# EAGLE design ethernet_dip_v1 (EAGLE 6.5.0)
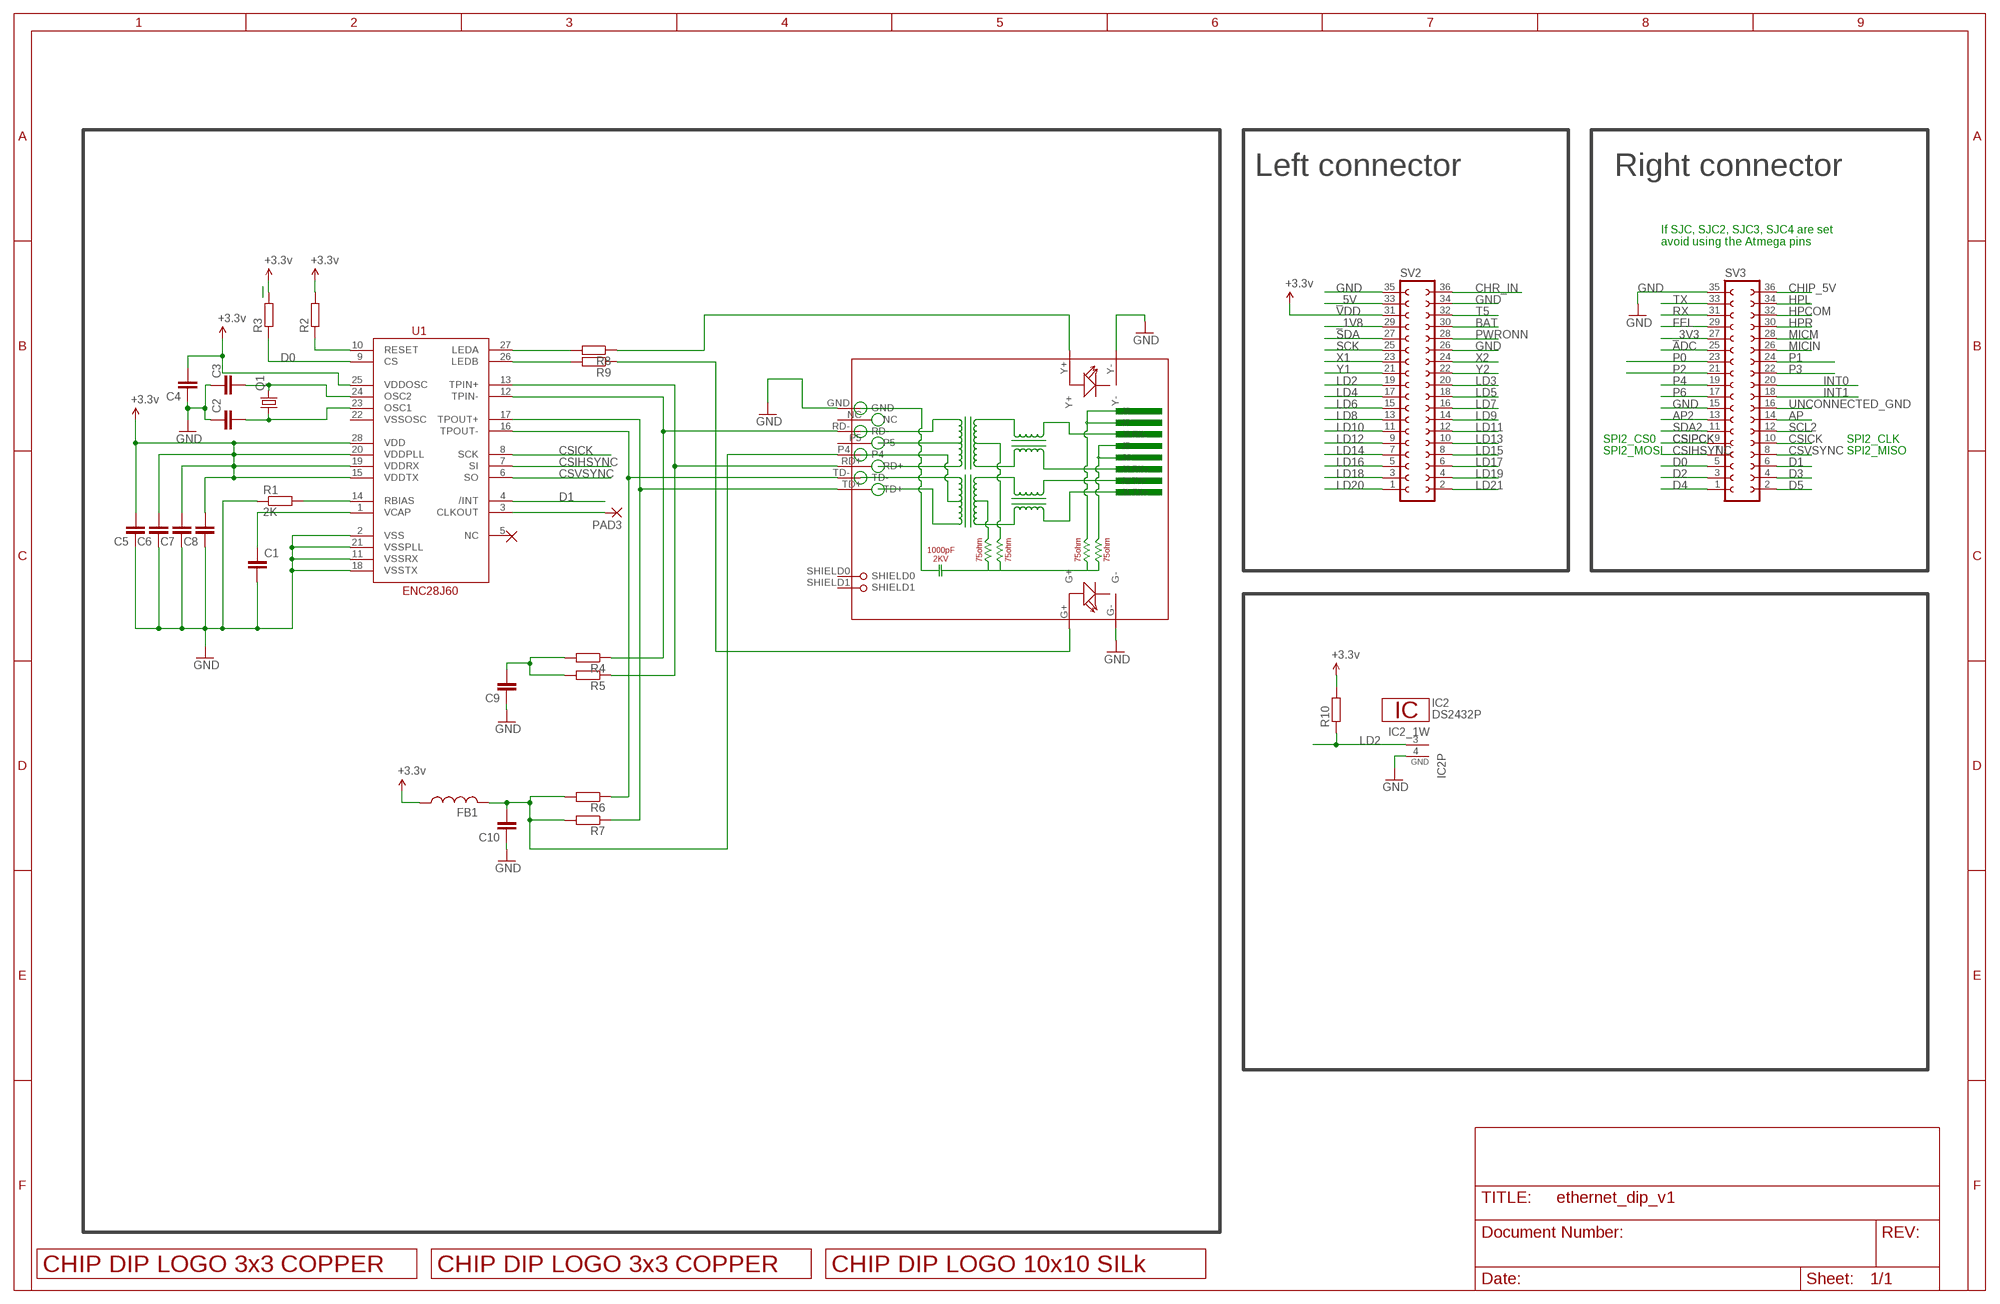
[diagram p0: schematic, sheet 1]

## Parts
C1  C-EUC0805  [C0805]
C2  C-EUC0805  [C0805]
C3  C-EUC0805  [C0805]
C4  C-EUC0805  [C0805]
C5  C-EUC0805  [C0805]
C6  C-EUC0805  [C0805]
C7  C-EUC0805  [C0805]
C8  C-EUC0805  [C0805]
C9  C-EUC0805  [C0805]
C10  C-EUC0805  [C0805]
FB1  FERRITE-BEADB  [0805]
IC2  DS2432P  [TSOC6]
PAD3  WIREPADSMD1,27-254  [SMD1,27-2,54]
Q1  CRYSTALSM49  [SM49]
R1  2K  R-EU_R0805  [R0805]
R2  R-EU_R0805  [R0805]
R3  R-EU_R0805  [R0805]
R4  R-EU_R0805  [R0805]
R5  R-EU_R0805  [R0805]
R6  R-EU_R0805  [R0805]
R7  R-EU_R0805  [R0805]
R8  R-EU_R0805  [R0805]
R9  R-EU_R0805  [R0805]
R10  R-EU_R0805  [R0805]
RJ1  HR911105A  [HR911105A]
SV2  FE18-2  [FE18-2]
SV3  FE18-2  [FE18-2]
U1  ENC28J60  [SSOP28DB]
U$2  LOGO_3X3_COPPER  [LOGO_3X3_COPPER]
U$4  LOGO_3X3_COPPER  [LOGO_3X3_COPPER]
U$5  LOGO_10X10_SILK  [LOGO_10X10_SILK]

## Nets
_1V8: SV2.29
_3V3: SV3.27
_5V: SV2.33
ADC: SV3.25
AP: SV3.14
AP2: SV3.13
BAT: SV2.30
CHIP_5V: SV3.36
CHR_IN: SV2.36
CSICK: SV3.10 U1.8(SCK)
CSIHSYNC: SV3.7 U1.7(SI)
CSIPCK: SV3.9
CSVSYNC: SV3.8 U1.6(SO)
CT: C10.2 FB1.2 R6.2 R7.2 RJ1.P4
D0: R3.1 SV3.5 U1.9(CS)
D1: SV3.6 U1.4(/INT)
D2: SV3.3
D3: SV3.4
D4: SV3.1
D5: SV3.2
FEL: SV3.29
GND: C1.2 C2.1 C3.1 C4.1 C5.1 C6.1 C7.1 C8.1 C9.1 C10.1 IC2.4(GND) R1.1 RJ1.G- RJ1.GND RJ1.Y- SV2.26 SV2.34 SV2.35 SV3.15 SV3.35 U1.2(VSS) U1.11(VSSRX) U1.18(VSSTX) U1.21(VSSPLL)
HPCOM: SV3.32
HPL: SV3.34
HPR: SV3.30
INT0: SV3.20
INT1: SV3.18
LD2: IC2.3(1W) R10.1 SV2.19
LD3: SV2.20
LD4: SV2.17
LD5: SV2.18
LD6: SV2.15
LD7: SV2.16
LD8: SV2.13
LD9: SV2.14
LD10: SV2.11
LD11: SV2.12
LD12: SV2.9
LD13: SV2.10
LD14: SV2.7
LD15: SV2.8
LD16: SV2.5
LD17: SV2.6
LD18: SV2.3
LD19: SV2.4
LD20: SV2.1
LD21: SV2.2
MICIN: SV3.26
MICM: SV3.28
N$1: C1.1 U1.1(VCAP)
N$2: R2.1 U1.10(RESET)
N$3: R1.2 U1.14(RBIAS)
N$6: C3.2 Q1.2 U1.24(OSC2)
N$7: C2.2 Q1.1 U1.23(OSC1)
N$10: R8.1 RJ1.Y+
N$11: R9.1 RJ1.G+
N$13: PAD3.1(P) U1.3(CLKOUT)
N$14: C9.2 R4.2 R5.2
N$15: R8.2 U1.27(LEDA)
N$16: R9.2 U1.26(LEDB)
P0: SV3.23
P1: SV3.24
P2: SV3.21
P3: SV3.22
P4: SV3.19
P6: SV3.17
PWRONN: SV2.28
RD+: R5.1 RJ1.RD+ U1.13(TPIN+)
RD-: R4.1 RJ1.RD- U1.12(TPIN-)
RX: SV3.31
SCK: SV2.25
SCL2: SV3.12
SDA: SV2.27
SDA2: SV3.11
T5: SV2.32
TD+: R7.1 RJ1.TD+ U1.17(TPOUT+)
TD-: R6.1 RJ1.TD- U1.16(TPOUT-)
TX: SV3.33
UNCONNECTED_GND: SV3.16
VDD: C4.2 C5.2 C6.2 C7.2 C8.2 FB1.1 R2.2 R3.2 R10.2 SV2.31 U1.15(VDDTX) U1.19(VDDRX) U1.20(VDDPLL) U1.25(VDDOSC) U1.28(VDD) ; supply symbol labelled +3.3v
X1: SV2.23
X2: SV2.24
Y1: SV2.21
Y2: SV2.22
Unconnected: RJ1.NC RJ1.P5 RJ1.SHIELD0 RJ1.SHIELD1 U1.5(NC) U1.22(VSSOSC)

## Notes on the sheet
- Left connector | Right connector
- If SJC, SJC2, SJC3, SJC4 are set 
  avoid using the Atmega pins
- SPI2_CS0 | SPI2_CLK
- SPI2_MOSI | SPI2_MISO

## Library data of the parts
C1-C10 = rcl:C-EU: CAPACITOR, European symbol
FB1 = m-pad-2.1:FERRITE-BEAD: Ferrite beads in various packages
IC2 = 1wire:DS2432: 1024-Bit Protected EEPROM with SHA-1 Engine This chip is a cryptographic device, providing 1024 Bits of EEPROM memory which may be written only after supplying the correct 64 bit secret. the secret cannot be read back from the device. The other features of this chip are like the DS2431. Please note the SHA-1 hash algorithm is considered weak if the data is not properly "padded". If you don't understand anything of this, don't use this chip. Author: Jan Kandziora <jjj@gmx.de>
PAD3 = wirepad:WIREPAD: Wire PAD connect wire on PCB
Q1 = adafruit:CRYSTAL: CRYSTAL; OC_FARNELL: unknown; OC_NEWARK: unknown
R1-R10 = rcl:R-EU_: RESISTOR, European symbol
RJ1 = CONNECTER:HR911105A
SV2 SV3 = con-lsta:FE18-2: FEMALE HEADER; OC_FARNELL: unknown; OC_NEWARK: unknown
U1 = SparkFun-DigitalIC:ENC28J60: Microchip SPI 10Base ethernet IC
U$2 U$4 = logo:LOGO_3X3_COPPER
U$5 = logo:LOGO_10X10_SILK

## Board
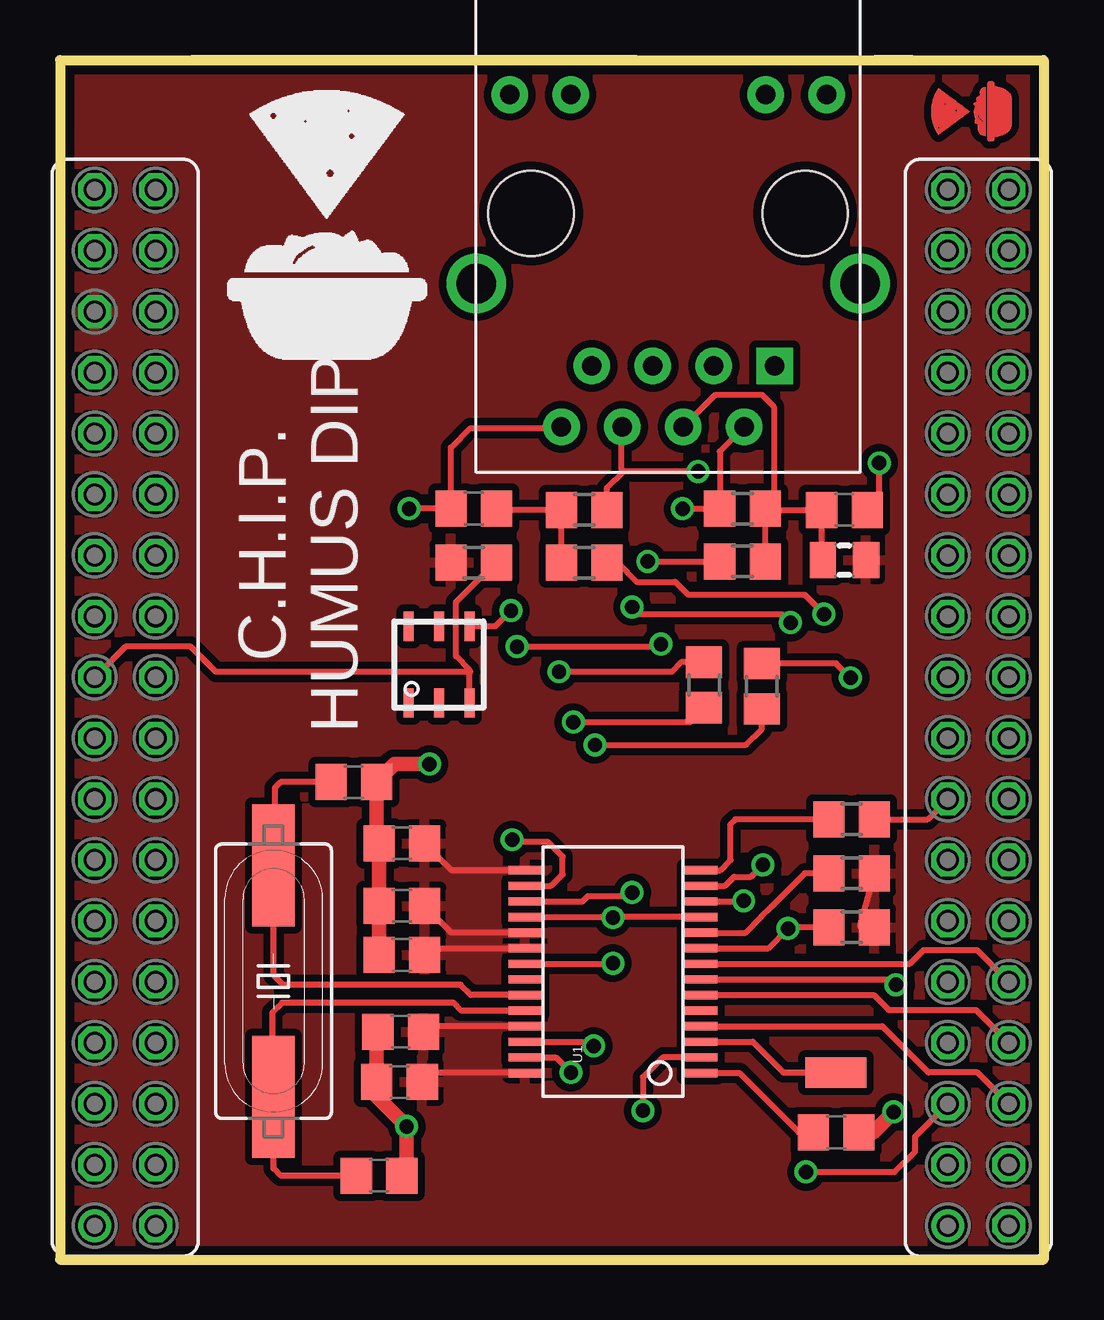
[diagram p1: board, top side]
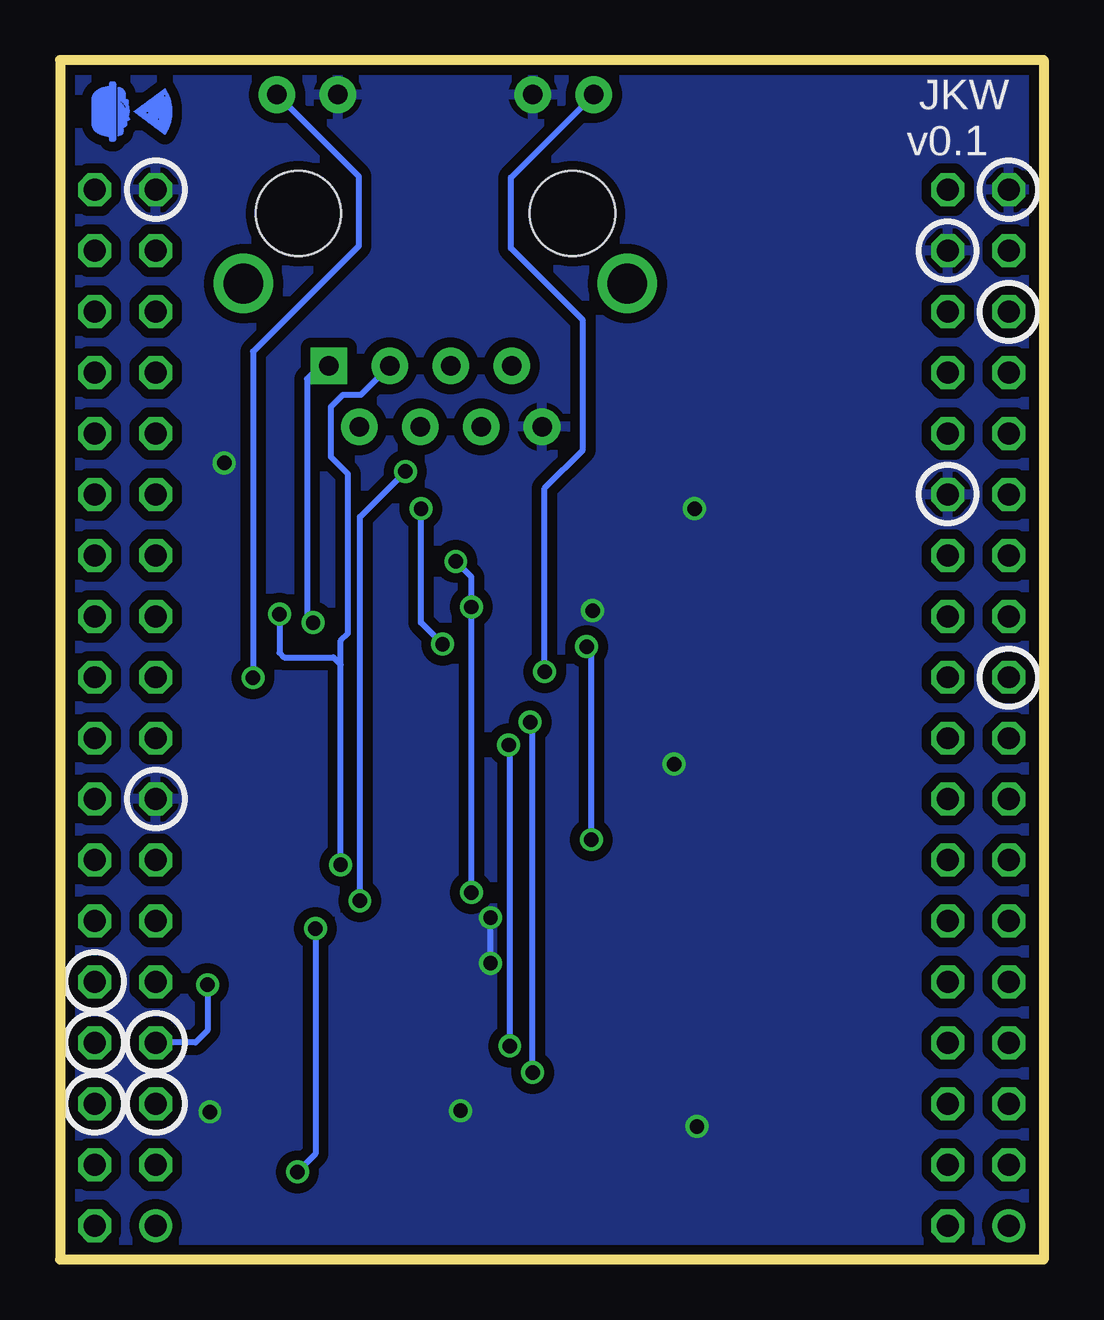
[diagram p2: board, bottom side, seen from below]

Size 41 x 50 mm. Coordinates in mm from the lower left corner, seen from the top.
Outline: 0,50 41,50 41,0 0,0 0,50
Copper layers (1*16): Top 0.0356mm / dielectric 1.5011mm / Bottom 0.0356mm
Design rules "LaenPCBOrder": minimum track width 6mil, minimum drill 13mil, track to track 6mil, track to pad 6mil, pad to pad 6mil, via to via 6mil, smd to smd 6mil, copper to edge 15mil, drill to drill 6mil, minimum pad ring 7mil, minimum via ring 7mil, stop-mask expansion 3mil, vias tented up to drill 0mil, thermal gap 10mil

### Footprints (pad centres in the part's own frame; a part is rotated, then mirrored left to right if it is on the bottom)
C0805 = smd 1.3 x 1.5: 1 -0.95,0; 2 0.95,0
0805 = smd 1.1 x 1.5: 1 -0.9,0; 2 0.9,0
TSOC6 = smd 0.406 x 1.219: 1 -1.27,-1.6; 2 0,-1.6; 3 1.27,-1.6; 4 1.27,1.6; 5 0,1.6; 6 -1.27,1.6
SMD1,27-2,54 = smd 1.27 x 2.54: 1 0,0
SM49 = smd 5.08 x 1.778: 1 -4.826,0; 2 4.826,0
R0805 = smd 1.3 x 1.5: 1 -0.95,0; 2 0.95,0
HR911105A = drill 0.813 pad 1.524: G+ 4.953,-6.604; G- 4.953,-4.064; GND -8.89,4.445; NC -6.35,3.175; P4 -8.89,-0.635; P5 -6.35,0.635; RD+ -6.35,-1.905; RD- -8.89,1.905; TD- -8.89,-3.175; Y+ 4.953,6.604; Y- 4.953,4.064 | drill 1.651 pad 2.159: SHIELD0 -2.921,8.001; SHIELD1 -2.921,-8.001 | drill 0.813 pad 1.524 square: TD+ -6.35,-4.445 | hole 3.556: 0,-5.715; 0,5.715
FE18-2 = drill 0.914: 1 -21.59,1.27 | drill 0.914 octagon: 2 -21.59,-1.27; 3 -19.05,1.27; 4 -19.05,-1.27; 5 -16.51,1.27; 6 -16.51,-1.27; 7 -13.97,1.27; 8 -13.97,-1.27; 9 -11.43,1.27; 10 -11.43,-1.27; 11 -8.89,1.27; 12 -8.89,-1.27; 13 -6.35,1.27; 14 -6.35,-1.27; 15 -3.81,1.27; 16 -3.81,-1.27; 17 -1.27,1.27; 18 -1.27,-1.27; 19 1.27,1.27; 20 1.27,-1.27; 21 3.81,1.27; 22 3.81,-1.27; 23 6.35,1.27; 24 6.35,-1.27; 25 8.89,1.27; 26 8.89,-1.27; 27 11.43,1.27; 28 11.43,-1.27; 29 13.97,1.27; 30 13.97,-1.27; 31 16.51,1.27; 32 16.51,-1.27; 33 19.05,1.27; 34 19.05,-1.27; 35 21.59,1.27; 36 21.59,-1.27
SSOP28DB = smd 0.348 x 1.397: 1 -4.225,-3.656; 2 -3.575,-3.656; 3 -2.925,-3.656; 4 -2.275,-3.656; 5 -1.625,-3.656; 6 -0.975,-3.656; 7 -0.325,-3.656; 8 0.325,-3.656; 9 0.975,-3.656; 10 1.625,-3.656; 11 2.275,-3.656; 12 2.925,-3.656; 13 3.575,-3.656; 14 4.225,-3.656; 15 4.225,3.656; 16 3.575,3.656; 17 2.925,3.656; 18 2.275,3.656; 19 1.625,3.656; 20 0.975,3.656; 21 0.325,3.656; 22 -0.325,3.656; 23 -0.975,3.656; 24 -1.625,3.656; 25 -2.275,3.656; 26 -2.925,3.656; 27 -3.575,3.656; 28 -4.225,3.656

### Placement (x,y rotation side)
C1  32.35,5.3 0 top
C2  12.25,19.9 180 top
C3  13.3,3.5 180 top
C4  14.2,9.5 0 top
C5  14.15,7.4 0 top
C6  14.25,12.7 0 top
C7  14.25,14.75 0 top
C8  14.25,17.35 0 top
C9  17.25,31.3 0 top
C10  32.7,31.25 180 top
FB1  32.7,29.15 180 top
IC2  15.8,24.8 0 top
PAD3  32.35,7.8 270 top
Q1  8.9,11.6 270 top
R1  33,18.35 180 top
R2  33,16.1 0 top
R3  33,13.85 0 top
R4  21.85,31.25 180 top
R5  21.85,29.05 180 top
R6  28.45,31.3 0 top
R7  28.45,29.1 0 top
R8  26.85,23.95 270 top
R9  29.25,23.9 270 top
R10  17.25,29.05 180 top
RJ1  25.35,43.6 90 top
SV2  2.72,23 90 top
SV3  38.28,23 90 top
U1  23.05,12 90 top
U$2  38,47.85 90 top
U$4  38,47.85 270 bottom
U$5  6.95,37.5 0 top

### Tracks (layer width: path | path; a pad name or v marks a point on that pad's centre or on a via)
CSICK
  Top 0.254: U1.8 35.42,12.32 36,12.9 38.22,12.9 SV3.10
CSIHSYNC  (via drill 0.6)
  Top 0.254: U1.7 34.62,11.68 v34.85,11.45
  Bottom 0.254: v34.85,11.45 34.85,9.55 35.35,9.05 36.99,9.05 SV3.7
CSVSYNC
  Top 0.254: U1.6 33.92,11.03 34.55,10.4 38.18,10.4 SV3.8
CT
  Top 0.254: R7.2 R6.2 | R6.2 29.45,31.25 C10.2 31.75,29.2 FB1.2 | RJ1.P4 27.32,36.05 29.25,36.05 29.75,35.55 29.75,31.65 R6.2
D0  (via drill 0.6)
  Top 0.254: U1.9 29.52,12.97 v30.35,13.8 30.4,13.85 R3.1 | v31.1,3.65 34.8,3.65 35.65,4.5 35.65,5.13 SV3.5
  Bottom 0.254: v30.35,13.8 30.35,4.4 v31.1,3.65
D1
  Top 0.254: U1.4 34.27,9.72 36.2,7.8 38.24,7.8 SV3.6
GND  (via drill 0.6)
  Top 0.254: U1.21 23.02,12.32 v23.05,12.35 | U1.18 23.02,14.28 v23.05,14.25 23.07,14.28 U1.11 | RJ1.GND 20.84,34.65 17.1,34.65 16.3,33.85 C9.1 v14.55,31.3 | U1.2 25.12,8.43 24.3,7.6 v24.3,6.2 | C10.1 34.15,31.75 v34.15,33.2 | IC2.4 18.15,26.4 v18.8,27.05 | R1.1 36.17,18.35 SV3.15
  Top 0.61: C6.1 C7.1 C8.1 13.2,17.45 C2.1 13.95,20.65 v15.4,20.65 | C3.1 14.45,3.7 v14.45,5.55 13.2,6.8 C5.1 13.2,9.45 C4.1 | C1.2 33.9,5.3 v34.75,6.15
  Bottom 0.254: v23.05,12.35 v23.05,14.25
  pour Bottom (isolate 0.406): 0,50 41.05,50 41.05,0.25 0.02,0.25 0.02,49.92
LD2
  Top 0.254: R10.1 18,28.9 16.5,27.4 16.5,25.15 17.07,24.58 IC2.3 17.07,24.47 17.1,24.5 6.5,24.5 5.45,25.55 2.73,25.55 SV2.19
N$1
  Top 0.254: U1.1 28.32,7.78 30.8,5.3 C1.1
N$2
  Top 0.254: U1.10 28.57,13.62 29.23,14.28 29.65,14.7 31.05,16.1 R2.1
N$3
  Top 0.254: U1.14 27.52,16.23 27.95,16.65 27.95,18.15 28.15,18.35 R1.2
N$6
  Top 0.254: U1.24 16.73,10.38 16.4,10.7 9.25,10.7 8.85,10.3 8.85,6.82 Q1.2 8.9,3.8 9.2,3.5 C3.2
N$7
  Top 0.254: U1.23 17.12,11.03 16.7,11.45 9.3,11.45 8.9,11.85 Q1.1 8.95,16.48 8.95,19.65 9.2,19.9 C2.2
N$10  (via drill 0.6)
  Top 0.254: R8.1 25.9,24.9 25.5,24.5 v20.8,24.5
  Bottom 0.254: v20.8,24.5 20.8,32.15 19.2,33.75 19.2,39.15 22.2,42.15 22.2,45.1 RJ1.Y+
N$11  (via drill 0.6)
  Top 0.254: v32.95,24.25 32.35,24.85 R9.1
  Bottom 0.254: RJ1.G+ 28.55,45.15 28.55,42.25 32.95,37.85 v32.95,24.25
N$13
  Top 0.254: U1.3 28.88,9.07 30.15,7.8 PAD3.1
N$14
  Top 0.254: R5.2 R4.2 18.25,31.25 C9.2
N$15  (via drill 0.6)
  Top 0.254: U1.27 20.68,8.43 v21.3,7.8 | v21.4,22.4 26.25,22.4 R8.2
  Bottom 0.254: v21.3,7.8 21.3,22.3 v21.4,22.4
N$16  (via drill 0.6)
  Top 0.254: U1.26 22.07,9.07 v22.25,8.9 | v22.3,21.45 28.6,21.45 29.25,22.1 R9.2
  Bottom 0.254: v22.25,8.9 22.25,21.4 v22.3,21.45
RD+  (via drill 0.6)
  Top 0.254: U1.13 27.73,15.57 28.1,15.95 28.8,15.95 v29.3,16.45 | R5.1 23.25,29.05 24.05,28.25 25.65,28.25 26.2,27.7 31.05,27.7 v31.85,26.9
  Bottom 0.254: v29.3,16.45 29.3,24.8 | 29.3,24.8 29.3,25.8 29,26.1 29,32.75 29.7,33.45 29.7,35.55 29.2,36.05 28.45,36.05 RJ1.RD+ | v31.85,26.9 31.85,25.3 31.65,25.1 29.6,25.1 29.3,24.8
RD-  (via drill 0.6)
  Top 0.254: U1.12 28.48,14.93 v28.5,14.95 | v26.6,32.85 23.5,32.85 | 23.5,32.85 23.4,32.95 23.4,34.66 RJ1.RD- | R4.1 22.8,32.15 23.5,32.85
  Bottom 0.254: v28.5,14.95 28.5,30.95 v26.6,32.85
TD+  (via drill 0.6)
  Top 0.254: U1.17 21.77,14.93 22,15.15 23.7,15.15 v23.85,15.3 | v24.5,29.1 R7.1 | v23.85,27.2 24.15,26.9 30.1,26.9 v30.45,26.55
  Bottom 0.254: v23.85,15.3 v23.85,27.2 23.85,28.45 v24.5,29.1 | RJ1.TD+ 30.15,37.25 30.7,36.7 30.7,26.8 v30.45,26.55
TD-  (via drill 0.6)
  Top 0.254: U1.16 20.48,15.57 20.95,16.05 20.95,16.8 20.35,17.4 18.95,17.4 v18.85,17.5 | v19.05,25.55 24.95,25.55 v25.05,25.65 | v25.95,31.3 R6.1 27.5,33.69 RJ1.TD-
  Bottom 0.254: v18.85,17.5 18.85,25.35 v19.05,25.55 | v25.05,25.65 25.95,26.55 v25.95,31.3
VDD
  Top 0.254: U1.28 15.47,7.78 C5.2 | U1.25 15.38,9.72 C4.2 | C6.2 15.47,12.97 U1.20 | U1.19 16.32,13.62 C7.2 | U1.15 16.32,16.23 C8.2 | R2.2 33.35,13.9 R3.2
  pour Top (isolate 0.305, rank 2): -0.07,0.25 40.88,0.25 41.01,10.57 41.01,50.01 0,50.01 0,10.47

### Text on the board
bPlace: JKW / v0.1
tNames: C.H.I.P. / HUMUS DIP